# EAGLE design thpg (EAGLE 9.3.0)
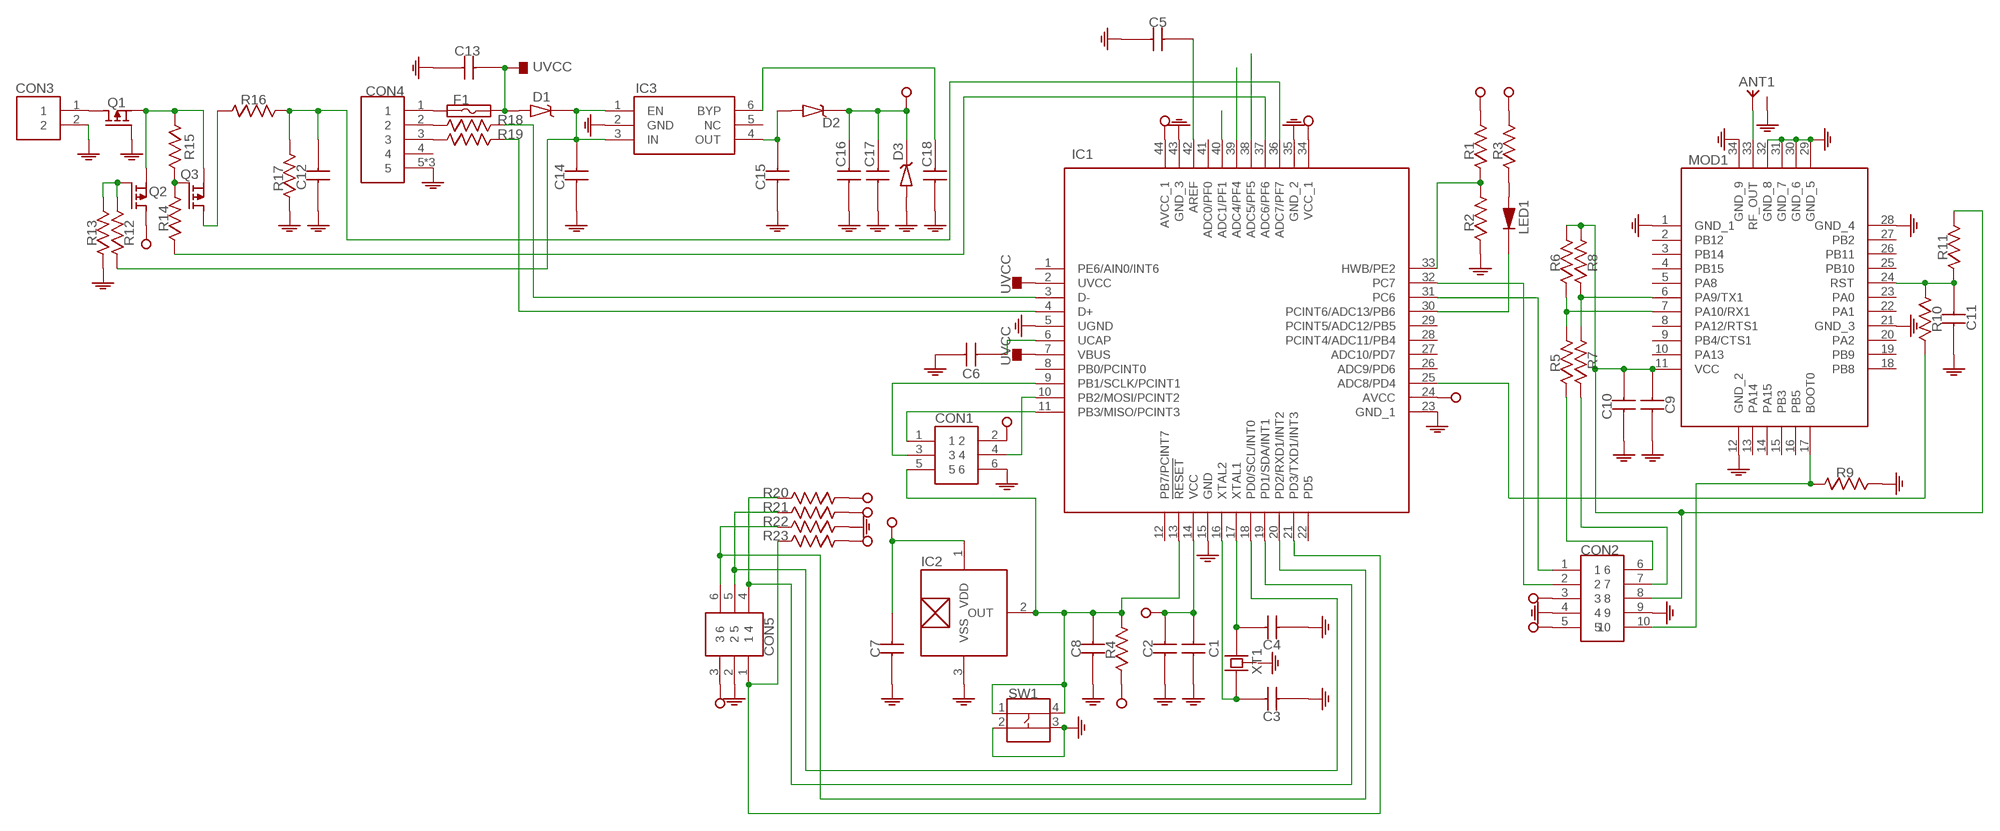
[diagram p0: schematic, sheet 1]

## Parts
ANT1  SMA-RF  [SMA-RF]
C1  CAPACITOR-0603  [0603]
C2  CAPACITOR-0603  [0603]
C3  CAPACITOR-0603  [0603]
C4  CAPACITOR-0603  [0603]
C5  CAPACITOR-0603  [0603]
C6  CAPACITOR-0603  [0603]
C7  CAPACITOR-0603  [0603]
C8  CAPACITOR-0603  [0603]
C9  CAPACITOR-0603  [0603]
C10  CAPACITOR-0603  [0603]
C11  CAPACITOR-0603  [0603]
C12  CAPACITOR-0603  [0603]
C13  CAPACITOR-0603  [0603]
C14  CAPACITOR-0805  [0805]
C15  CAPACITOR-0805  [0805]
C16  CAPACITOR-0603  [0603]
C17  CAPACITOR-0603  [0603]
C18  CAPACITOR-0603  [0603]
CON1  ISP  [ISP]
CON2  HEADER-10P-2R-DIP-2_54MM  [HEADER-10P-2R-DIP-2_54MM]
CON3  JST-PH-2-2.0MM  [JST-PH-2-2.0MM]
CON4  USB-MICRO-DIP-VER  [USB-MICRO-DIP-VER]
CON5  HEADER-6P-2R-DIP-2_54MM  [HEADER-6P-2R-DIP-2_54MM]
D1  DIODE-SCHOTTKY  [SOD123-DIODE]
D2  DIODE-SCHOTTKY  [SOD123-DIODE]
D3  ZENER-SOD123  [SOD123-DIODE]
F1  FUSE-0805  [0805]
IC1  ATMEGA32U4-MU  [QFN-44]
IC2  S-5712-SOT23-3  [SOT23-3]
IC3  MIC5219-VDFN-6  [VDFN-6]
LED1  LED-0603  [LED-0603]
MOD1  RAK811  [RAK811]
Q1  P-MOSFET  [SOT23-3]
Q2  P-MOSFET  [SOT23-3]
Q3  P-MOSFET  [SOT23-3]
R1  RESISTOR-0603  [0603]
R2  RESISTOR-0603  [0603]
R3  RESISTOR-0603  [0603]
R4  RESISTOR-0603  [0603]
R5  RESISTOR-0603  [0603]
R6  RESISTOR-0603  [0603]
R7  RESISTOR-0603  [0603]
R8  RESISTOR-0603  [0603]
R9  RESISTOR-0603  [0603]
R10  RESISTOR-0603  [0603]
R11  RESISTOR-0603  [0603]
R12  RESISTOR-0603  [0603]
R13  RESISTOR-0603  [0603]
R14  RESISTOR-0603  [0603]
R15  RESISTOR-0603  [0603]
R16  RESISTOR-0603  [0603]
R17  RESISTOR-0603  [0603]
R18  RESISTOR-0603  [0603]
R19  RESISTOR-0603  [0603]
R20  RESISTOR-0603  [0603]
R21  RESISTOR-0603  [0603]
R22  RESISTOR-0603  [0603]
R23  RESISTOR-0603  [0603]
SW1  BUTTON-4P-SMD-5X5  [BUTTON-4P-SMD-5X5]
XT1  CRYSTAL-5032-4P  [CRYSTAL-5032-4P]

## Nets
GND: ANT1.2(GND) ANT1.3(GND) ANT1.4(GND) ANT1.5(GND) C1.1 C2.1 C3.1 C4.1 C5.1 C6.1 C7.1 C8.1 C9.1 C10.1 C11.1 C12.1 C13.1 C14.1 C15.1 C16.1 C17.1 C18.1 CON1.6 CON2.4 CON2.9 CON3.2 CON4.5 CON4.6 CON4.7 CON5.2 D3.2(A) IC1.5(UGND) IC1.15(GND) IC1.23(GND_1) IC1.35(GND_2) IC1.43(GND_3) IC2.3(VSS) IC3.2(GND) MOD1.1(GND_1) MOD1.12(GND_2) MOD1.21(GND_3) MOD1.28(GND_4) MOD1.29(GND_5) MOD1.30(GND_6) MOD1.31(GND_7) MOD1.32(GND_8) MOD1.34(GND_9) Q1.1(G) R2.1 R9.2 R13.1 R17.1 R22.1 SW1.2 SW1.3
N$2: C11.2 MOD1.24(RST) R10.1 R11.1
N$3: CON1.1 IC1.11(PB3/MISO/PCINT3)
N$4: ANT1.1(ANT) MOD1.33(RF_OUT)
N$5: CON5.5 IC1.18(PD0/SCL/INT0) R21.2
N$6: MOD1.7(PA10/RX1) R5.2 R6.1
N$7: MOD1.6(PA9/TX1) R7.2 R8.1
N$9: CON1.4 IC1.10(PB2/MOSI/PCINT2)
N$10: C3.2 IC1.16(XTAL2) XT1.1
N$11: CON2.1 IC1.31(PC6)
N$12: C4.2 IC1.17(XTAL1) XT1.3
N$13: C9.2 C10.2 CON2.8 MOD1.11(VCC) R6.2 R8.2 R11.2
N$14: CON2.7 R7.1
N$15: CON5.4 IC1.19(PD1/SDA/INT1) R20.2
N$16: IC1.25(ADC8/PD4) R10.2
N$17: IC1.39(ADC4/PF4)
N$18: IC1.38(ADC5/PF5)
N$19: IC1.30(PCINT6/ADC13/PB6) LED1.1(K)
N$27: IC1.40(ADC1/PF1)
N$29: CON2.2 IC1.32(PC7)
N$31: C5.2 IC1.42(AREF)
N$32: Q3.1(G) R14.2 R15.2
N$33: CON4.1 F1.1
N$34: C6.2 IC1.6(UCAP)
N$35: LED1.2(A) R3.1
N$36: C12.2 IC1.36(ADC7/PF7) R16.2 R17.2
N$37: C18.2 IC3.6(BYP)
N$38: C14.2 D1.1(K) IC3.1(EN) IC3.3(IN) R12.1
N$40: C15.2 D2.2(A) IC3.4(OUT)
N$41: CON4.2 R18.1
N$42: CON4.3 R19.1
N$43: IC1.3(D-) R18.2
N$44: IC1.4(D+) R19.2
N$45: CON1.3 IC1.9(PB1/SCLK/PCINT1)
N$47: IC1.37(ADC6/PF6) R14.1
N$53: Q2.1(G) R12.2 R13.2
N$55: CON3.1 Q1.3(D)
N$57: CON5.6 IC1.20(PD2/RXD1/INT2) R22.2
N$58: Q1.2(S) Q2.2(S) Q3.2(S) R15.1
N$59: Q3.3(D) R16.1
N$60: CON2.6 R5.1
N$61: IC1.33(HWB/PE2) R1.1 R2.2
N$62: CON5.1 IC1.21(PD3/TXD1/INT3) R23.2
N$63: CON2.10 MOD1.17(BOOT0) R9.1
N$64: C8.2 CON1.5 IC1.13(!RESET) IC2.2(OUT) R4.2 SW1.1 SW1.4
UVCC: C13.2 D1.2(A) F1.2 IC1.2(UVCC) IC1.7(VBUS)
VCC: C1.2 C2.2 C7.2 C16.2 C17.2 CON1.2 CON2.3 CON2.5 CON5.3 D2.1(K) D3.1(K) IC1.14(VCC) IC1.24(AVCC) IC1.34(VCC_1) IC1.44(AVCC_1) IC2.1(VDD) Q2.3(D) R1.2 R3.2 R4.1 R20.1 R21.1 R23.1
Unconnected: CON4.4 IC1.1(PE6/AIN0/INT6) IC1.8(PB0/PCINT0) IC1.12(PB7/PCINT7) IC1.22(PD5) IC1.26(ADC9/PD6) IC1.27(ADC10/PD7) IC1.28(PCINT4/ADC11/PB4) IC1.29(PCINT5/ADC12/PB5) IC1.41(ADC0/PF0) IC3.5(NC) MOD1.2(PB12) MOD1.3(PB14) MOD1.4(PB15) MOD1.5(PA8) MOD1.8(PA12/RTS1) MOD1.9(PB4/CTS1) MOD1.10(PA13) MOD1.13(PA14) MOD1.14(PA15) MOD1.15(PB3) MOD1.16(PB5) MOD1.18(PB8) MOD1.19(PB9) MOD1.20(PA2) MOD1.22(PA1) MOD1.23(PA0) MOD1.25(PB10) MOD1.26(PB11) MOD1.27(PB2)

## Power pins joined to a net without a drawn wire
GND: XT1.2(GND) XT1.4(GND)

## Library data of the parts
ANT1 = SamacSys_Parts:SMA-RF
C1-C13 C16-C18 = SamacSys_Parts:CAPACITOR-0603
C14 C15 = SamacSys_Parts:CAPACITOR-0805
CON1 = SamacSys_Parts:ISP
CON2 = SamacSys_Parts:HEADER-10P-2R-DIP-2_54MM
CON3 = SamacSys_Parts:JST-PH-2-2.0MM
CON4 = SamacSys_Parts:USB-MICRO-DIP-VER
CON5 = SamacSys_Parts:HEADER-6P-2R-DIP-2_54MM
D1 D2 = SamacSys_Parts:DIODE-SCHOTTKY
D3 = SamacSys_Parts:ZENER-SOD123
F1 = SamacSys_Parts:FUSE-0805
IC1 = SamacSys_Parts:ATMEGA32U4-MU
IC2 = SamacSys_Parts:S-5712-SOT23-3
IC3 = SamacSys_Parts:MIC5219-VDFN-6
LED1 = SamacSys_Parts:LED-0603
MOD1 = SamacSys_Parts:RAK811
Q1-Q3 = SamacSys_Parts:P-MOSFET
R1-R23 = SamacSys_Parts:RESISTOR-0603
SW1 = SamacSys_Parts:BUTTON-4P-SMD-5X5
XT1 = SamacSys_Parts:CRYSTAL-5032-4P

## Board
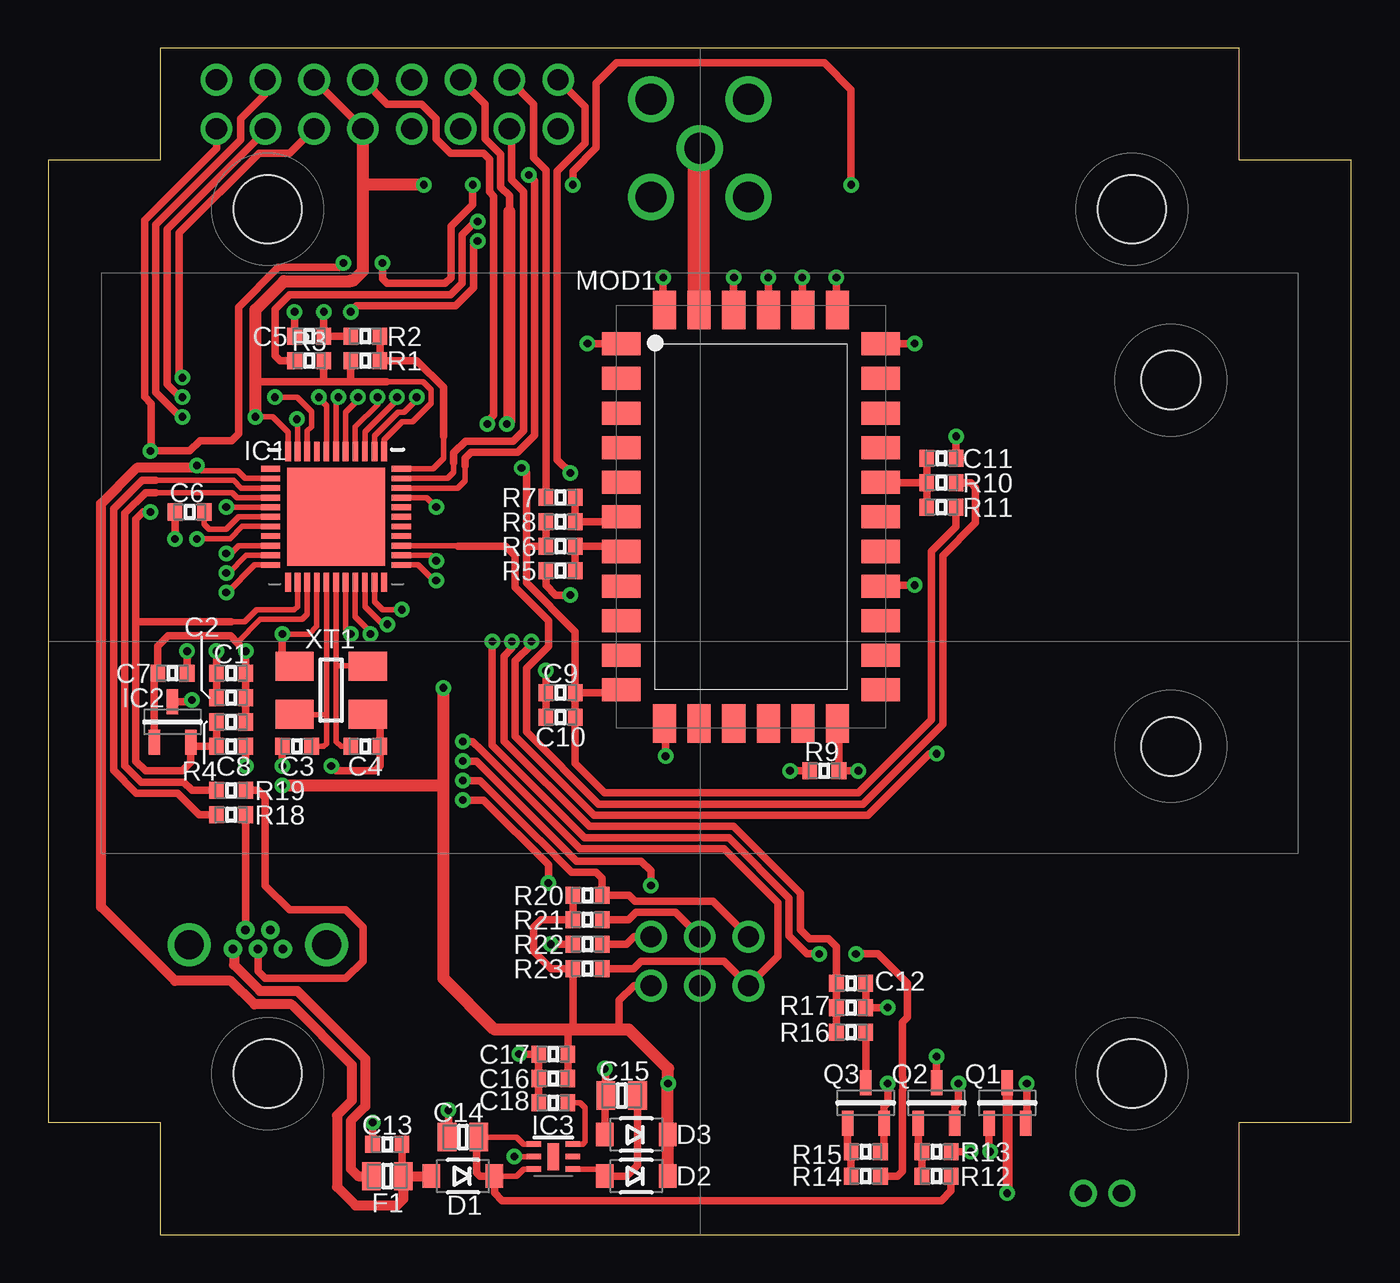
[diagram p1: board, top side]
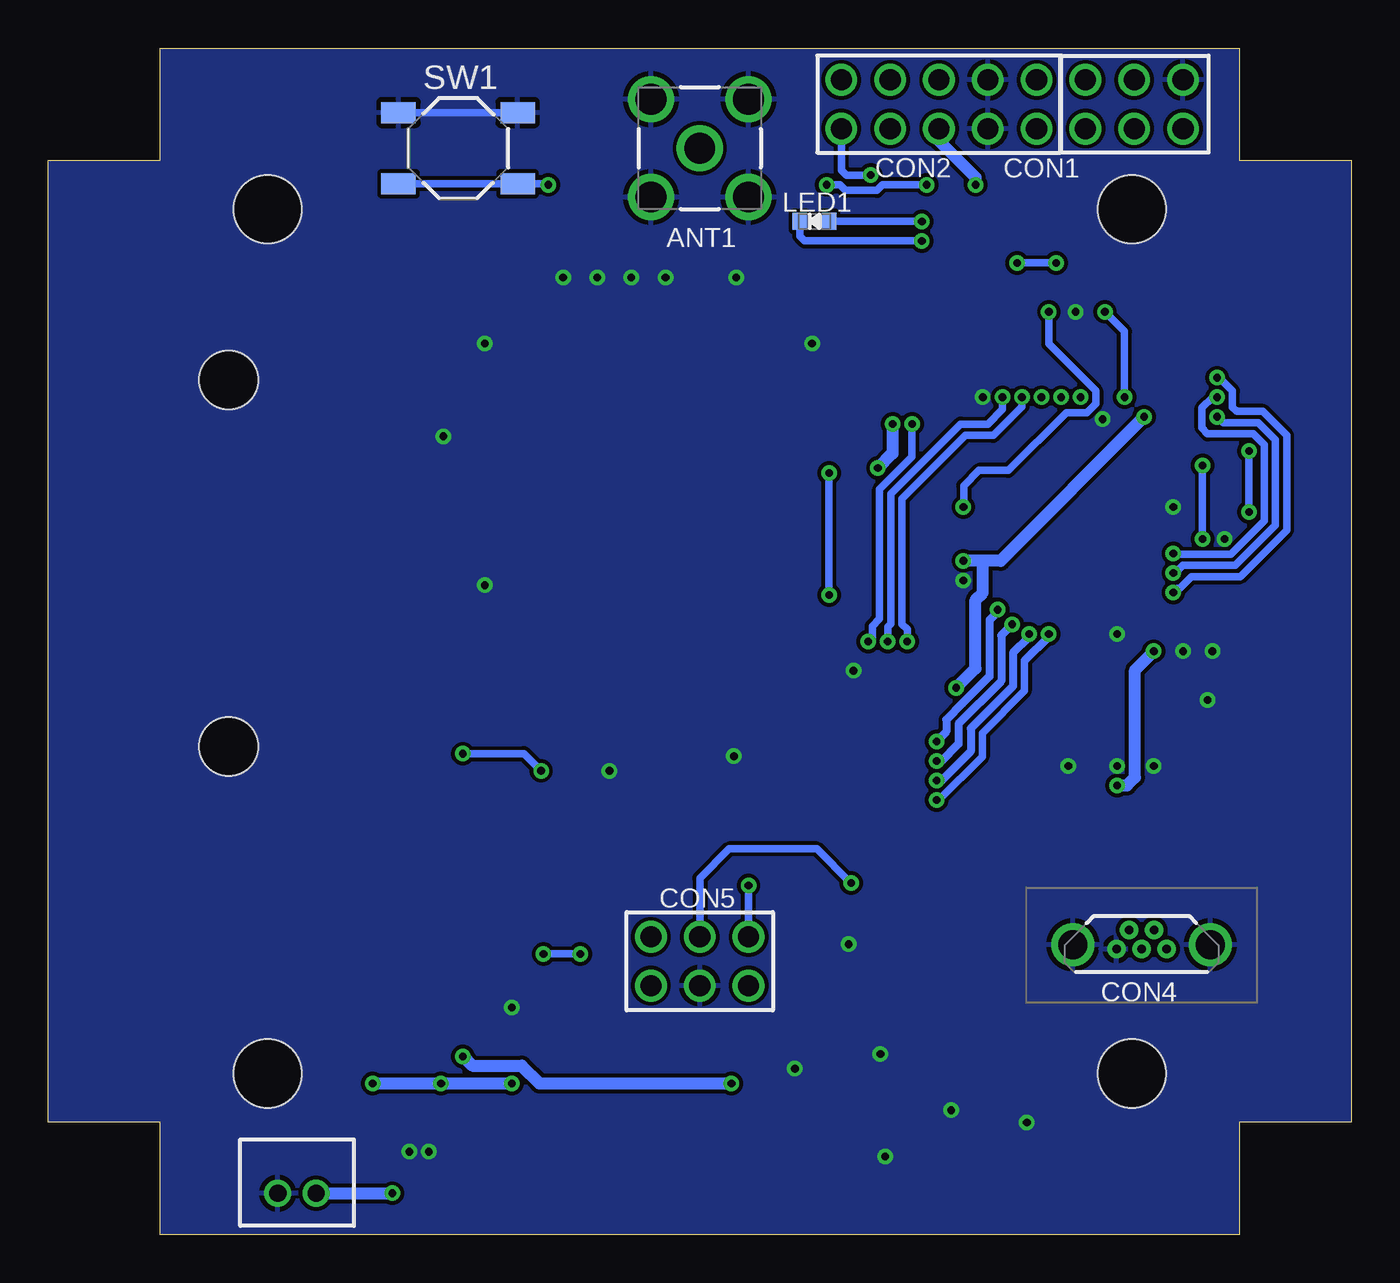
[diagram p2: board, bottom side, seen from below]

Size 67.82 x 61.72 mm. Coordinates in mm from the lower left corner, seen from the top.
Outline: 0,5.84 5.84,5.84 5.84,0 61.98,0 61.98,5.84 67.82,5.84 67.82,55.88 61.98,55.88 61.98,61.72 5.84,61.72 5.84,55.88 0,55.88 0,5.84
Copper layers (1*16): Top 0.035mm / dielectric 1.5mm / Bottom 0.035mm
Design rules "qfn": minimum track width 10mil, minimum drill 0.4mm, track to track 8mil, track to pad 10mil, pad to pad 8mil, via to via 8mil, smd to smd 0mil, copper to edge 0mil, drill to drill 6mil, minimum pad ring 10mil, minimum via ring 8mil, stop-mask expansion 4mil, vias tented up to drill 25mil, thermal gap 10mil
Holes 3.56 mm at 11.43,8.38 56.39,8.38 56.39,53.34 11.43,53.34
Holes 3.05 mm at 58.42,44.45 58.42,25.4
bRestrict: area 27.7,52.2 to 28.2,53.2

### Footprints (pad centres in the part's own frame; a part is rotated, then mirrored left to right if it is on the bottom)
SMA-RF = drill 1.6: 1 0,0; 2 -2.54,2.54; 3 -2.54,-2.54; 4 2.54,-2.54; 5 2.54,2.54
0603 = smd 0.762 x 0.889: 1 -0.762,0; 2 0.762,0
0805 = smd 0.97 x 1.47: 1 -0.83,0; 2 0.83,0
ISP = drill 1.1 pad 1.65: 1 0,0; 2 2.54,0; 3 0,-2.54; 4 2.54,-2.54; 5 0,-5.08; 6 2.54,-5.08
HEADER-10P-2R-DIP-2_54MM = drill 1.1 pad 1.65: 1 0,0; 2 2.54,0; 3 5.08,0; 4 7.62,0; 5 10.16,0; 6 0,2.54; 7 2.54,2.54; 8 5.08,2.54; 9 7.62,2.54; 10 10.16,2.54
JST-PH-2-2.0MM = drill 0.9: 1 -1,0; 2 1,0
USB-MICRO-DIP-VER = drill 0.45: 1 -1.3,0; 2 -0.65,-1; 3 0,0; 4 0.65,-1; 5 1.3,0 | drill 1.5: 6 -3.575,-0.22; 7 3.575,-0.22
HEADER-6P-2R-DIP-2_54MM = drill 1.1 pad 1.65: 1 -2.54,-1.27; 2 0,-1.27; 3 2.54,-1.27; 4 -2.54,1.27; 5 0,1.27; 6 2.54,1.27
SOD123-DIODE = smd 0.91 x 1.22: 1 -1.635,0; 2 1.635,0
QFN-44 = smd 1 x 0.3: 1 -3.4,2.5; 2 -3.4,2; 3 -3.4,1.5; 4 -3.4,1; 5 -3.4,0.5; 6 -3.4,0; 7 -3.4,-0.5; 8 -3.4,-1; 9 -3.4,-1.5; 10 -3.4,-2; 11 -3.4,-2.5; 23 3.4,-2.5; 24 3.4,-2; 25 3.4,-1.5; 26 3.4,-1; 27 3.4,-0.5; 28 3.4,0; 29 3.4,0.5; 30 3.4,1; 31 3.4,1.5; 32 3.4,2; 33 3.4,2.5 | smd 0.3 x 1: 12 -2.5,-3.4; 13 -2,-3.4; 14 -1.5,-3.4; 15 -1,-3.4; 16 -0.5,-3.4; 17 0,-3.4; 18 0.5,-3.4; 19 1,-3.4; 20 1.5,-3.4; 21 2,-3.4; 22 2.5,-3.4; 34 2.5,3.4; 35 2,3.4; 36 1.5,3.4; 37 1,3.4; 38 0.5,3.4; 39 0,3.4; 40 -0.5,3.4; 41 -1,3.4; 42 -1.5,3.4; 43 -2,3.4; 44 -2.5,3.4 | smd 5.1 x 5.1: 45 0,0
SOT23-3 = smd 1.3 x 0.6: 1 -1.05,0.95; 2 -1.05,-0.95; 3 1.05,0
VDFN-6 = smd 0.75 x 0.3: 1 -1.025,0.65; 2 -1.025,0; 3 -1.025,-0.65; 4 1.025,-0.65; 5 1.025,0; 6 1.025,0.65 | smd 0.6 x 1.4: 7 0,0
LED-0603 = smd 0.762 x 0.889: 1 -0.762,0; 2 0.762,0
RAK811 = smd 2 x 1.2: 1 -6.75,9; 2 -6.75,7.2; 3 -6.75,5.4; 4 -6.75,3.6; 5 -6.75,1.8; 6 -6.75,0; 7 -6.75,-1.8; 8 -6.75,-3.6; 9 -6.75,-5.4; 10 -6.75,-7.2; 11 -6.75,-9; 18 6.75,-9; 19 6.75,-7.2; 20 6.75,-5.4; 21 6.75,-3.6; 22 6.75,-1.8; 23 6.75,0; 24 6.75,1.8; 25 6.75,3.6; 26 6.75,5.4; 27 6.75,7.2; 28 6.75,9 | smd 1.2 x 2: 12 -4.5,-10.75; 13 -2.7,-10.75; 14 -0.9,-10.75; 15 0.9,-10.75; 16 2.7,-10.75; 17 4.5,-10.75; 29 4.5,10.75; 30 2.7,10.75; 31 0.9,10.75; 32 -0.9,10.75; 33 -2.7,10.75; 34 -4.5,10.75
BUTTON-4P-SMD-5X5 = smd 1.8 x 1.1: 1 -3.1,1.85; 2 -3.1,-1.85; 3 3.1,-1.85; 4 3.1,1.85
CRYSTAL-5032-4P = smd 2 x 1.5: 1 -1.9,-1.25; 2 1.9,-1.25; 3 1.9,1.25; 4 -1.9,1.25

### Placement (x,y rotation side)
ANT1  33.91,56.52 0 bottom
C1  9.53,29.21 0 top
C2  9.53,27.94 0 top
C3  12.95,25.4 0 top
C4  16.51,25.4 180 top
C5  13.59,46.74 180 top
C6  7.37,37.59 0 top
C7  6.48,29.21 180 top
C8  9.53,25.4 180 top
C9  26.67,28.19 0 top
C10  26.67,26.92 0 top
C11  46.48,40.39 180 top
C12  41.78,13.08 180 top
C13  17.65,4.7 0 top
C14  21.59,5.08 0 top
C15  29.84,7.24 0 top
C16  26.29,8.13 0 top
C17  26.29,9.4 0 top
C18  26.29,6.86 0 top
CON1  13.84,57.53 90 bottom
CON2  26.54,57.53 0 bottom
CON3  54.86,2.16 180 bottom
CON4  10.92,14.86 180 bottom
CON5  33.91,14.22 0 bottom
D1  21.59,3.05 180 top
D2  30.61,3.05 180 top
D3  30.61,5.21 180 top
F1  17.65,3.05 0 top
IC1  14.99,37.34 0 top
IC2  6.48,26.67 90 top
IC3  26.29,4.06 0 top
LED1  27.94,52.7 0 bottom
MOD1  36.58,37.34 0 top
Q1  49.91,6.86 90 top
Q2  46.23,6.86 90 top
Q3  42.55,6.86 90 top
R1  16.51,45.47 180 top
R2  16.51,46.74 0 top
R3  13.59,45.47 0 top
R4  9.53,26.67 180 top
R5  26.67,34.54 0 top
R6  26.67,35.81 180 top
R7  26.67,38.35 0 top
R8  26.67,37.08 180 top
R9  40.39,24.13 180 top
R10  46.48,39.12 0 top
R11  46.48,37.85 0 top
R12  46.23,3.05 180 top
R13  46.23,4.32 180 top
R14  42.55,3.05 180 top
R15  42.55,4.32 180 top
R16  41.78,10.54 180 top
R17  41.78,11.81 180 top
R18  9.53,21.84 180 top
R19  9.53,23.11 180 top
R20  28.07,17.65 0 top
R21  28.07,16.38 0 top
R22  28.07,15.11 0 top
R23  28.07,13.84 0 top
SW1  46.48,56.52 180 bottom
XT1  14.73,28.32 0 top

### Tracks (layer width: path | path; a pad name or v marks a point on that pad's centre or on a via)
GND  (via drill 0.4)
  Top 0.292: IC1.43 12.99,42.39 v12.95,42.42 | IC1.35 16.99,41.5 16.99,41.57 18.21,42.79 18.53,42.79 19.18,43.43 v19.18,43.56 | IC1.5 9.28,37.84 v9.27,37.85 | IC1.15 13.99,31.64 13.58,31.24 v12.2,31.24 v12.19,31.24 | IC3.2 v24.26,4.06 | IC1.23 19.26,34.84 20.07,34.04 v20.19,34.04
  Top 0.381: C3.1 v12.19,24.38 | v14.73,24.38 14.99,24.13 17.02,24.13 17.27,24.38 C4.1 17.27,26.43 XT1.2 | C8.1 v10.29,24.38 | C7.1 v7.24,30.35 | IC2.3 7.4,27.72 v7.49,27.81 | v8.76,30.35 C1.1 C2.1 | MOD1.34 32,48.16 v32,49.78 | MOD1.1 29.81,46.35 v28.07,46.35 | MOD1.32 35.68,49.77 v35.69,49.78 | MOD1.31 v37.48,49.77 v37.47,49.78 | MOD1.30 39.24,48.12 v39.24,49.78 | MOD1.29 41.02,48.14 v41.02,49.78 | MOD1.28 43.34,46.35 v45.09,46.35 | MOD1.21 43.37,33.78 v45.09,33.78 | MOD1.12 32.13,26.53 v32.13,24.89 | C10.1 C9.1 v25.91,29.34 | C6.1 v6.6,36.2 | R9.2 v38.61,24.13 | v20.83,6.48 20.83,5.15 C14.1 | C13.1 v16.89,5.84 | C18.1 C16.1 C17.1 v24.51,9.4 | D3.2 28.97,7.2 C15.1 29.02,8.58 v28.96,8.64 | C12.1 R17.1 v43.69,11.81 | R13.1 v48.01,4.32 | Q1.1 48.96,4.38 v49.02,4.32 | R2.1 C5.1 v14.35,48.01 | C11.1 v47.24,41.53 | v12.19,31.24 12.19,30.21 XT1.4 | R22.1 v26.16,15.11
  Bottom 0.381: SW1.2 SW1.3
  pour Bottom: 0.13,5.97 0.13,55.75 5.97,55.75 5.97,61.59 61.85,61.59 61.85,55.75 67.69,55.75 67.69,5.97 61.85,5.97 61.85,0.13 5.97,0.13 5.97,5.97
N$2
  Top 0.381: C11.2 R10.1 | R10.1 R11.1 | R10.1 43.35,39.12 MOD1.24
N$3  (via drill 0.4)
  Top 0.292: IC1.11 10.76,34.84 9.32,33.4 v9.27,33.4
  Top 0.381: CON1.1 12.57,56.26 10.99,56.26 6.83,52.11 6.83,44.73 v6.99,44.58
  Bottom 0.381: v9.27,33.4 9.05,33.62 8.94,33.62 8.33,34.23 5.79,34.23 3.37,36.65 3.37,41.58 4.61,42.82 5.97,42.82 6.19,43.04 6.19,43.89 6.87,44.58 v6.99,44.58
N$4
  Top 1.143: MOD1.33 33.88,56.48 ANT1.1
N$5  (via drill 0.4)
  Top 0.292: v15.75,31.24 15.49,31.5 IC1.18
  Top 0.381: v21.59,22.61 22.66,22.61 26.04,19.24 v26.04,18.29 | R21.2 30.21,16.38 30.59,16.76 32.64,16.76 CON5.5
  Bottom 0.381: 17,29.86 17.02,29.84 17.02,28.29 19.21,26.09 19.21,24.87 21.48,22.61 v21.59,22.61 | v26.04,18.29 27.81,20.07 32.38,20.07 33.91,18.54 CON5.5
  Bottom 0.406: 17,29.86 15.75,31.11 v15.75,31.24
N$6
  Top 0.381: R5.2 R6.1 29.55,35.81 MOD1.7
N$7
  Top 0.381: R7.2 R8.1 29.57,37.08 MOD1.6
N$9  (via drill 0.4)
  Top 0.292: IC1.10 10.32,35.34 9.4,34.42 v9.27,34.42
  Top 0.381: CON1.4 11.3,59.33 10.03,58.06 10.03,56.96 5.6,52.53 5.6,43.81 6.87,42.55 v6.99,42.55
  Bottom 0.381: v9.27,34.42 9.16,34.42 8.76,34.81 6.03,34.81 3.95,36.89 3.95,41.34 4.85,42.24 6.68,42.24 v6.99,42.55
N$10
  Top 0.292: IC1.16 14.49,27.05 | 14.49,27.05 14.49,25.54 14.35,25.4 C3.2 | XT1.1 12.85,27.05 14.49,27.05
N$11  (via drill 0.4)
  Top 0.292: IC1.31 21.31,38.84 21.7,39.22 21.7,40.01
  Top 0.381: v25.02,55.12 25.32,54.81 25.32,41.58 24.43,40.69 22,40.69 21.7,40.39 21.7,40.01
  Bottom 0.381: v25.02,55.12 26.29,55.12 26.54,55.37 CON2.1
N$12
  Top 0.292: IC1.17 14.99,29.59 | 14.99,29.59 14.99,25.65 15.24,25.4 C4.2 | XT1.3 16.61,29.59 14.99,29.59
N$13  (via drill 0.4)
  Top 0.381: C9.2 C10.2 27.43,24.51 28.96,22.99 42.16,22.99 45.97,26.8 45.97,35.56 47.24,36.83 R11.2 | C9.2 29.68,28.19 MOD1.11 | R8.2 R6.2 24.89,35.81 | C9.2 27.43,31.37 24.89,33.91 24.89,35.81 | v24.64,39.88 24.89,39.62 24.89,35.81 | CON2.8 22.73,58.8 22.73,57.01 23.55,56.19 23.55,54.49 24,54.04 24,53.21
  Top 0.635: v23.88,42.16 24,42.29 24,53.21
  Bottom 0.635: v23.88,42.16 23.88,40.64 v24.64,39.88
N$14
  Top 0.381: CON2.7 25.27,58.8 25.27,56.01 25.91,55.37 R7.1
N$15  (via drill 0.4)
  Top 0.292: v16.76,31.24 16.76,31.37 15.99,32.15 IC1.19
  Top 0.381: v21.59,23.62 22.48,23.62 25.52,20.57 25.59,20.51 27.25,18.85 28.52,18.85 28.83,18.54 R20.2 30.23,17.65 30.53,17.35 34.59,17.35 CON5.4
  Bottom 0.406: v16.76,31.24 16.76,31.11 17.61,30.26 17.61,28.54 19.81,26.34 19.81,25.15 21.34,23.62 v21.59,23.62
N$16
  Top 0.292: 21.34,35.81 21.31,35.84 IC1.25
  Top 0.381: R10.2 48.01,39.12 48.26,38.86 48.26,37.02 46.56,35.32 46.56,26.55 42.41,22.4 28.65,22.4 24.89,26.16 24.89,29.46 26.04,30.61 26.04,31.94 24.31,33.67 24.31,35.31 23.8,35.81 21.34,35.81
N$17  (via drill 0.4)
  Top 0.292: IC1.39 14.99,43.43 v15.11,43.56
N$18  (via drill 0.4)
  Top 0.292: IC1.38 15.49,42.79 16.13,43.43 v16.13,43.56
N$19  (via drill 0.4)
  Top 0.292: IC1.30 19.7,38.34 v20.19,37.85
  Top 0.381: v15.75,48.01 16.05,48.31 21.2,48.31 22.14,49.25 22.14,51.48 v22.35,51.69
  Bottom 0.381: LED1.1 28.7,51.94 28.45,51.69 v22.35,51.69 | v15.75,48.01 15.75,46.34 13.3,43.89 13.3,43.23 13.77,42.76 14.85,42.76 17.86,39.75 19.38,39.75 20.17,38.96 20.17,37.87 v20.19,37.85
N$27  (via drill 0.4)
  Top 0.292: v14.1,43.56 14.1,43.51 14.49,43.12 IC1.40
N$29
  Top 0.292: IC1.32 20.8,39.34 21.11,39.66 21.11,40.16
  Top 0.381: CON2.2 24.13,57.4 24.13,54.86 24.74,54.25 24.74,41.82 24.19,41.27 21.72,41.27 21.11,40.67 21.11,40.16
N$31  (via drill 0.4)
  Top 0.292: IC1.42 13.49,41.81 13.72,42.04 13.72,42.8 12.95,43.56 v11.81,43.56
  Top 0.381: C5.2 v12.83,48.01
  Bottom 0.381: v11.81,43.56 11.81,46.99 v12.83,48.01
N$32
  Top 0.381: Q3.1 41.59,4.51 R15.2 R14.2
N$33
  Top 0.508: CON4.1 9.68,14.8 9.68,14.04 11.04,12.69 12.97,12.69 16.51,9.14 16.51,6.68 15.75,5.92 15.75,3.43 16.13,3.05 F1.1
N$34
  Top 0.292: IC1.6 9.91,37.34 9.27,36.7 8.38,36.7 8.13,36.96 C6.2
N$35  (via drill 0.4)
  Top 0.381: R3.1 12.06,45.47 11.81,45.72 11.81,48.13 12.57,48.9 20.95,48.9 21.55,49.49 21.55,52.02 22.24,52.7 v22.35,52.7
  Bottom 0.381: LED1.2 v22.35,52.7
N$36  (via drill 0.4)
  Top 0.292: IC1.36 16.49,41.63 16.49,41.64 16.49,41.77 18.16,43.44 v18.16,43.56
  Top 0.381: R16.2 R17.2 C12.2 41.02,14.99 40.6,15.4 39.61,15.4 39.14,15.88 39.14,17.76 35.66,21.23 28.17,21.23 23.72,25.68 23.72,30.1 24.13,30.5 v24.13,30.86
  Bottom 0.381: v24.13,30.86 24.13,31.62 23.97,31.79 23.97,38.53 20.34,42.16 18.92,42.16 18.16,42.93 v18.16,43.56
N$37
  Top 0.292: IC3.6 27.83,4.71 27.94,4.83 27.94,6.6 27.69,6.86 C18.2
N$38
  Top 0.292: IC3.1 24.75,4.71 24.38,5.08 C14.2 | IC3.3 24.75,3.41 24.38,3.05 D1.1
  Top 0.381: R12.1 46.99,2.29 46.48,1.78 23.62,1.78 23.23,2.17 D1.1 22.48,3.05 22.29,3.23 22.29,4.95 C14.2
N$40
  Top 0.292: IC3.4 28.61,3.41 D2.2
  Top 0.381: C15.2 30.68,3.62 30.1,3.05 D2.2
N$41
  Top 0.381: R18.1 10.29,19.3 10.27,19.29 CON4.2
N$42
  Top 0.381: CON4.3 10.92,13.72 11.3,13.34 15.49,13.34 16.38,14.22 16.38,16 15.49,16.89 12.57,16.89 11.3,18.16 11.3,22.73 10.92,23.11 R19.1
N$43
  Top 0.292: IC1.3 10.06,38.84 9.65,39.24 5.59,39.24
  Top 0.381: 5.59,39.24 4.89,39.24 3.4,37.76 3.4,24.15 4.6,22.96 6.76,22.96 7.87,21.84 R18.2
N$44
  Top 0.292: IC1.4 9.84,38.34 9.58,38.6 5.6,38.6
  Top 0.381: 5.6,38.6 5.07,38.6 3.99,37.52 3.99,24.4 4.84,23.55 7.06,23.55 7.49,23.11 R19.2
N$45  (via drill 0.4)
  Top 0.292: IC1.9 9.93,35.84 9.53,35.43 v9.27,35.43
  Top 0.381: CON1.3 11.3,57.4 6.19,52.29 6.19,44.25 6.87,43.56 v6.99,43.56
  Bottom 0.381: v9.27,35.43 9.24,35.4 6.27,35.4 4.54,37.13 4.54,41.1 5.1,41.66 7.49,41.66 7.49,41.67 7.78,41.96 7.78,43 7.22,43.56 v6.99,43.56
N$47  (via drill 0.4)
  Top 0.292: IC1.37 15.99,42.02 17.14,43.18 v17.14,43.56
  Top 0.381: R14.1 44.2,3.05 44.45,3.3 44.45,7.51 44.48,7.54 44.48,8.2 44.45,8.24 44.45,11.05 44.7,11.3 44.7,13.08 43.18,14.61 v42.04,14.61 | v23.11,30.86 23.11,25.46 27.93,20.65 35.42,20.65 38.56,17.51 38.56,15.54 39.5,14.61 v40.13,14.61
  Bottom 0.381: v42.04,14.61 v40.13,14.61 | v17.14,43.56 17.14,43.07 18.63,41.58 20.09,41.58 23.38,38.29 23.38,31.75 23.11,31.48 v23.11,30.86
N$53
  Top 0.381: Q2.1 45.28,4.51 R13.2 R12.2
N$55  (via drill 0.4)
  Top 0.508: Q1.3 v49.91,2.16
  Bottom 0.635: CON3.1 v49.91,2.16
N$57  (via drill 0.4)
  Top 0.292: v17.65,31.75 17.4,31.75 16.49,32.66 IC1.20
  Top 0.381: v21.59,24.64 22.29,24.64 27.49,19.43 30.86,19.43 31.37,18.92 v31.37,18.16 | CON5.6 30.48,15.49 30.1,15.11 R22.2
  Bottom 0.381: CON5.6 v31.37,18.16
  Bottom 0.406: v17.65,31.75 18.22,31.18 18.22,28.79 20.45,26.57 20.45,25.53 21.34,24.64 v21.59,24.64
N$58  (via drill 0.4)
  Top 0.381: R15.1 43.49,4.51 Q3.2 43.49,6.67 43.69,6.86 v43.69,7.87 | Q2.2 47.18,6.67 47.37,6.86 v47.37,7.87 | v50.93,7.87 50.93,5.87 Q1.2
  Bottom 0.635: v43.69,7.87 v47.37,7.87 v50.93,7.87
N$59
  Top 0.381: Q3.3 R16.1
N$60  (via drill 0.4)
  Top 0.381: CON2.6 27.94,58.67 27.94,56.77 26.49,55.32 26.49,40.31 v27.18,39.62 | R5.1 25.91,33.78 26.42,33.27 v27.18,33.27
  Bottom 0.381: v27.18,33.27 v27.18,39.62
N$61
  Top 0.292: IC1.33 20.03,39.84 20.57,40.39 20.57,41.53
  Top 0.381: R2.2 R1.1 19.18,45.47 20.57,44.07 20.57,41.53
N$62  (via drill 0.4)
  Top 0.292: IC1.21 16.99,32.92 17.4,32.51 v18.41,32.51
  Top 0.381: v21.59,25.65 22.1,25.65 22.53,25.22 27.68,20.07 35.18,20.07 37.97,17.27 37.97,14.48 CON5.1 35.18,14.22 30.84,14.22 30.46,13.84 R23.2
  Bottom 0.406: v21.59,25.65 21.08,26.16 21.08,26.8 20.24,27.64 18.83,29.04 18.83,31.97 18.41,32.38 v18.41,32.51
N$63  (via drill 0.4)
  Top 0.381: MOD1.17 41.15,26.52 R9.1 v42.16,24.13 | CON2.10 17.65,58.8 19.45,58.8 20.19,58.06 20.19,57.01 20.94,56.26 22.65,56.26 22.96,55.95 22.96,54.24 23.19,54.01 23.19,42.62 22.86,42.29 v22.86,42.16 | v46.23,25.02 45.85,25.02 42.65,21.82 28.41,21.82 24.31,25.92 24.31,29.86 25.15,30.7 v25.15,30.86
  Bottom 0.381: v46.23,25.02 43.05,25.02 v42.16,24.13 | v25.15,30.86 24.93,31.08 24.93,31.65 24.55,32.03 24.55,38.77 22.86,40.47 v22.86,42.16
N$64  (via drill 0.4)
  Top 0.292: IC1.13 12.99,32.67 12.81,32.5 10.84,32.5 10.22,31.88 9.53,31.88
  Top 0.381: R4.2 C8.2 7.65,25.4 IC2.2 7.43,24.57 6.99,24.13 5.08,24.13 4.57,24.64 4.57,31.88 | CON1.5 8.76,56.52 5.02,52.77 5.02,43.57 5.37,43.22 5.37,40.81 v5.33,40.77 7.38,40.77 7.92,41.31 9.56,41.31 9.91,41.66 9.91,48.24 11.98,50.32 15.14,50.32 v15.37,50.55 | v5.33,37.59 4.95,37.59 4.57,37.21 4.57,31.88 | 9.53,31.88 4.57,31.88 | v41.78,54.61 41.78,59.56 40.39,60.96 29.59,60.96 28.52,59.89 28.52,56.53 27.3,55.31 v27.3,54.61 | v17.4,50.55 17.4,49.73 17.65,49.48 20.67,49.48 20.97,49.78 20.97,52.45 22.1,53.58 v22.1,54.61
  Bottom 0.381: v5.33,40.77 v5.33,37.59 | SW1.4 SW1.1 41.84,54.66 v41.78,54.61 | v22.1,54.61 24.4,54.61 24.69,54.32 26.32,54.32 26.61,54.61 v27.3,54.61 | v17.4,50.55 v15.37,50.55
UVCC  (via drill 0.4)
  Top 0.292: IC1.7 10.11,36.84 9.48,36.21 v7.76,36.21 v7.75,36.2 | v7.75,40.01 7.75,39.99 8,39.74 9.86,39.74 10.26,39.34 IC1.2
  Top 0.381: C13.2 18.41,3.12 F1.2
  Top 0.508: v7.75,40.01 7.63,39.89 4.62,39.89 2.76,38.03 2.76,17.06 6.6,13.21 9.51,13.21 10.74,11.98 12.66,11.98 15.8,8.84 15.8,6.97 15.04,6.21 15.04,2.49 16,1.52 18.16,1.52 18.48,1.85 F1.2 D1.2
  Bottom 0.381: v7.75,40.01 v7.75,36.2
VCC  (via drill 0.4)
  Top 0.292: IC1.14 13.49,32.28 13.21,32 11.05,32 9.84,30.8 | IC1.24 19.91,35.34 v20.19,35.05 | IC1.44 12.49,41.74 11.68,42.55 v10.79,42.55 | IC1.34 17.49,41.36 18.41,42.29 18.97,42.29 19.94,43.26 19.94,43.94 19.52,44.36 17.62,44.36
  Top 0.381: R4.1 C2.2 C1.2 v10.29,30.35 9.84,30.8 9.49,31.15 6.26,31.15 5.71,30.61 C7.2 5.53,29.02 IC2.1 | C16.2 C17.2 27.05,10.67 | Q2.3 v46.23,9.27 | CON1.2 CON2.5 | 17.62,44.36 15.75,44.36 | 15.75,44.36 14.35,44.36 | R1.2 15.75,44.36 | R3.2 14.35,44.36 | 10.79,44.58 11.01,44.36 14.35,44.36 | R20.1 R21.1 25.65,16.38 25.27,16 25.27,14.73 26.16,13.84 R23.1 27.3,10.67 | CON5.3 30.48,12.95 29.72,12.19 29.72,10.67
  Top 0.635: D2.1 D3.1 32.24,7.86 v32.26,7.87 32.26,8.64 30.23,10.67 29.72,10.67 27.3,10.67 27.05,10.67 23.24,10.67 20.57,13.34 20.57,23.37 | v10.79,42.55 10.79,44.58 10.79,48.12 12.28,49.61 15.75,49.61 15.76,49.62 15.88,49.62 16.38,50.13 16.38,54.61 | 16.38,54.61 CON2.5 | v19.56,54.61 16.38,54.61 | 20.57,23.37 v20.57,28.45 | v12.19,23.37 20.57,23.37
  Bottom 0.635: v46.23,9.27 45.76,8.8 43.18,8.8 42.25,7.87 v32.26,7.87 | v12.19,23.37 11.68,23.37 11.27,23.78 11.27,29.37 v10.29,30.35 | CON2.3 21.46,56.9 19.56,54.99 v19.56,54.61 | 19.3,35.05 18.25,35.05 10.79,42.51 v10.79,42.55 | 19.3,35.05 v20.19,35.05 | v20.57,28.45 19.56,29.46 19.56,33.02 19.18,33.4 19.18,34.92 19.3,35.05